# EAGLE design MegaBot (EAGLE 9.6.2)
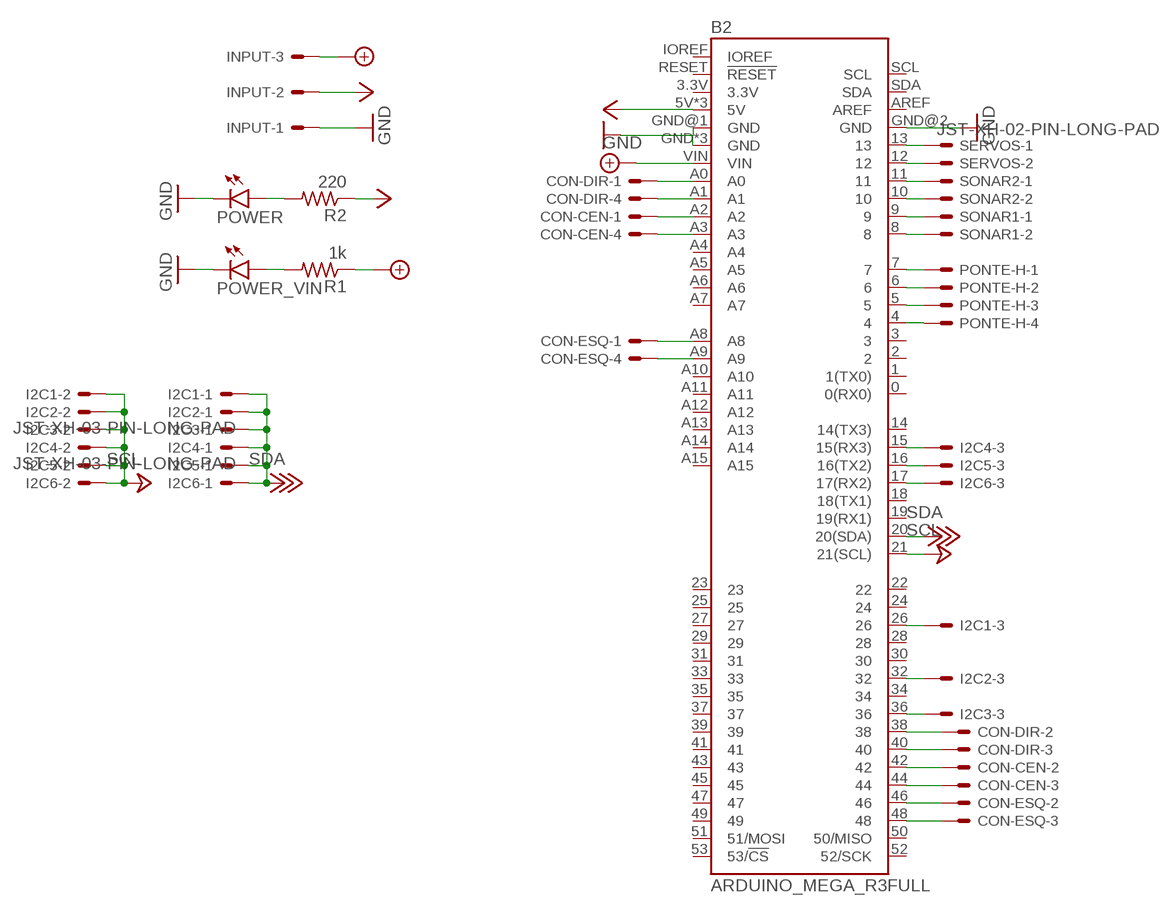
[diagram p0: schematic, sheet 1]

## Parts
B2  ARDUINO_MEGA_R3FULL  [ARDUINO_MEGA_NO_SILK]
CON-CEN  JST-XH-04-PIN-LONG-PAD  [JST-XH-04-PACKAGE-LONG-PAD]
CON-DIR  JST-XH-04-PIN-LONG-PAD  [JST-XH-04-PACKAGE-LONG-PAD]
CON-ESQ  JST-XH-04-PIN-LONG-PAD  [JST-XH-04-PACKAGE-LONG-PAD]
I2C1  JST-XH-03-PIN-LONG-PAD  [JST-XH-03-PACKAGE-LONG-PAD]
I2C2  JST-XH-03-PIN-LONG-PAD  [JST-XH-03-PACKAGE-LONG-PAD]
I2C3  JST-XH-03-PIN-LONG-PAD  [JST-XH-03-PACKAGE-LONG-PAD]
I2C4  JST-XH-03-PIN-LONG-PAD  [JST-XH-03-PACKAGE-LONG-PAD]
I2C5  JST-XH-03-PIN-LONG-PAD  [JST-XH-03-PACKAGE-LONG-PAD]
I2C6  JST-XH-03-PIN-LONG-PAD  [JST-XH-03-PACKAGE-LONG-PAD]
INPUT  KK-156-3  [KK-156-3]
PONTE-H  JST-XH-04-PIN-LONG-PAD  [JST-XH-04-PACKAGE-LONG-PAD]
POWER  LEDLED5MM_LONG_PAD  [LED5MM_LONG_PAD]
POWER_VIN  LEDLED5MM_LONG_PAD  [LED5MM_LONG_PAD]
R1  1k  R-US_0204/7  [0204/7]
R2  220  R-US_0204/7  [0204/7]
SERVOS  JST-XH-02-PIN-LONG-PAD  [JST-XH-02-PACKAGE-LONG-PAD]
SONAR1  JST-XH-02-PIN-LONG-PAD  [JST-XH-02-PACKAGE-LONG-PAD]
SONAR2  JST-XH-02-PIN-LONG-PAD  [JST-XH-02-PACKAGE-LONG-PAD]

## Nets
+8V: B2.VIN INPUT.3 R1.1
+18V: B2.20(20(SDA)) I2C1.1 I2C2.1 I2C3.1 I2C4.1 I2C5.1 I2C6.1 ; supply symbol labelled SDA
+24V: B2.21(21(SCL)) I2C1.2 I2C2.2 I2C3.2 I2C4.2 I2C5.2 I2C6.2 ; supply symbol labelled SCL
GND: B2.GND B2.GND@1(GND) B2.GND@2(GND) B2.GND@3(GND) B2.GND@4(GND) INPUT.1 POWER.K(C) POWER_VIN.K(C)
N$1: B2.7 PONTE-H.1
N$2: B2.6 PONTE-H.2
N$3: B2.5 PONTE-H.3
N$4: B2.4 PONTE-H.4
N$5: B2.38 CON-DIR.2
N$6: B2.40 CON-DIR.3
N$7: B2.42 CON-CEN.2
N$8: B2.44 CON-CEN.3
N$9: B2.46 CON-ESQ.2
N$10: B2.48 CON-ESQ.3
N$11: B2.A0 CON-DIR.1
N$12: B2.A1 CON-DIR.4
N$13: B2.A2 CON-CEN.1
N$14: B2.A3 CON-CEN.4
N$15: B2.A8 CON-ESQ.1
N$16: B2.A9 CON-ESQ.4
N$17: B2.11 SONAR2.1
N$18: B2.10 SONAR2.2
N$19: B2.9 SONAR1.1
N$20: B2.8 SONAR1.2
N$21: B2.26 I2C1.3
N$22: B2.32 I2C2.3
N$23: B2.36 I2C3.3
N$24: B2.15(15(RX3)) I2C4.3
N$25: B2.16(16(TX2)) I2C5.3
N$26: B2.17(17(RX2)) I2C6.3
N$27: B2.13 SERVOS.1
N$28: B2.12 SERVOS.2
N$29: POWER_VIN.A R1.2
N$32: POWER.A R2.2
VCC: B2.5V B2.5V@1(5V) B2.5V@2(5V) INPUT.2 R2.1
Unconnected: B2.0(0(RX0)) B2.1(1(TX0)) B2.2 B2.3 B2.3.3V B2.14(14(TX3)) B2.18(18(TX1)) B2.19(19(RX1)) B2.22 B2.23 B2.24 B2.25 B2.27 B2.28 B2.29 B2.30 B2.31 B2.33 B2.34 B2.35 B2.37 B2.39 B2.41 B2.43 B2.45 B2.47 B2.49 B2.50(50/MISO) B2.51(51/MOSI) B2.52(52/SCK) B2.53(53/!CS) B2.A4 B2.A5 B2.A6 B2.A7 B2.A10 B2.A11 B2.A12 B2.A13 B2.A14 B2.A15 B2.AREF B2.IOREF B2.RESET(!RESET) B2.SCL B2.SDA

## Library data of the parts
B2 = SparkFun-Boards:ARDUINO_MEGA_R3: Arduino Mega R3 ATmega2560 R3 compatible footprint. SparkFun Products: Arduino Mega 2560 R3 <https://www.sparkfun.com/products/11061>
CON-CEN CON-DIR CON-ESQ PONTE-H = Rembrandt Electronics - JST XH Connectors v1-0:JST-XH-04-PIN: JST XH Connector 2 Pin Wire to board connector. Pitch: 2,54 mm, (0.100") Number of pins: 4 Created by Rembrandt Electronics www.rembrandtelectronics.com
I2C1-I2C6 = Rembrandt Electronics - JST XH Connectors v1-0:JST-XH-03-PIN: JST XH Connector 2 Pin Wire to board connector. Pitch: 2,54 mm, (0.100") Number of pins: 3 Created by Rembrandt Electronics www.rembrandtelectronics.com
INPUT = con-molex:KK-156-3: KK 156 HEADER Source: http://www.molex.com/pdm_docs/sd/026604100_sd.pdf; MF: MOLEX; OC_FARNELL: unknown; OC_NEWARK: unknown
POWER POWER_VIN = led_robotica:LED: LED OSRAM: - CHIPLED LG R971, LG N971, LY N971, LG Q971, LY Q971, LO R971, LY R971 LH N974, LH R974 LS Q976, LO Q976, LY Q976 LO Q996 - Hyper CHIPLED LW Q18S LB Q993, LB Q99A, LB R99A - SideLED LS A670, LO A670, LY A670, LG A670, LP A670 LB A673, LV A673, LT A673, LW A673 LH A674 LY A675 LS A676, LA A676, LO A676, LY A676, LW A676 LS A679, LY A679, LG A679 - Hyper Micro SIDELED® LS Y876, LA Y876, LO Y876, LY Y876 LT Y87S - SmartLED LW L88C, LW L88S LB L89C, LB L89S, LG L890 LS L89K, LO L89K, LY L89K LS L896, LA L896, LO L896, LY L896 - TOPLED LS T670, LO T670, LY T670, LG T670, LP T670 LSG T670, LSP T670, LSY T670, LOP T670, LYG T670 LG T671, LOG T671, LSG T671 LB T673, LV T673, LT T673, LW T673 LH T674 LS T676, LA T676, LO T676, LY T676, LB T676, LH T676, LSB T676, LW T676 LB T67C, LV T67C, LT T67C, LS T67K, LO T67K, LY T67K, LW E67C LS E67B, LA E67B, LO E67B, LY E67B, LB E67C, LV E67C, LT E67C LW T67C LS T679, LY T679, LG T679 LS T770, LO T770, LY T770, LG T770, LP T770 LB T773, LV T773, LT T773, LW T773 LH T774 LS E675, LA E675, LY E675, LS T675 LS T776, LA T776, LO T776, LY T776, LB T776 LHGB T686 LT T68C, LB T68C - Hyper Mini TOPLED® LB M676 - Mini TOPLED Santana® LG M470 LS M47K, LO M47K, LY M47K Source: http://www.osram.convergy.de LUXEON: - LUMILED® LXK2-PW12-R00, LXK2-PW12-S00, LXK2-PW14-U00, LXK2-PW14-V00 LXK2-PM12-R00, LXK2-PM12-S00, LXK2-PM14-U00 LXK2-PE12-Q00, LXK2-PE12-R00, LXK2-PE12-S00, LXK2-PE14-T00, LXK2-PE14-U00 LXK2-PB12-K00, LXK2-PB12-L00, LXK2-PB12-M00, LXK2-PB14-N00, LXK2-PB14-P00, LXK2-PB14-Q00 LXK2-PR12-L00, LXK2-PR12-M00, LXK2-PR14-Q00, LXK2-PR14-R00 LXK2-PD12-Q00, LXK2-PD12-R00, LXK2-PD12-S00 LXK2-PH12-R00, LXK2-PH12-S00 LXK2-PL12-P00, LXK2-PL12-Q00, LXK2-PL12-R00 Source: www.luxeon.com KINGBRIGHT: KA-3528ASYC Source: www.kingbright.com
R1 R2 = rcl_robotica:R-US_: RESISTOR, American symbol; SPICEPREFIX: R
SERVOS SONAR1 SONAR2 = Rembrandt Electronics - JST XH Connectors v1-0:JST-XH-02-PIN: JST XH Connector 2 Pin Wire to board connector. Pitch: 2,54 mm, (0.100") Number of pins: 2 Created by Rembrandt Electronics www.rembrandtelectronics.com

## Board
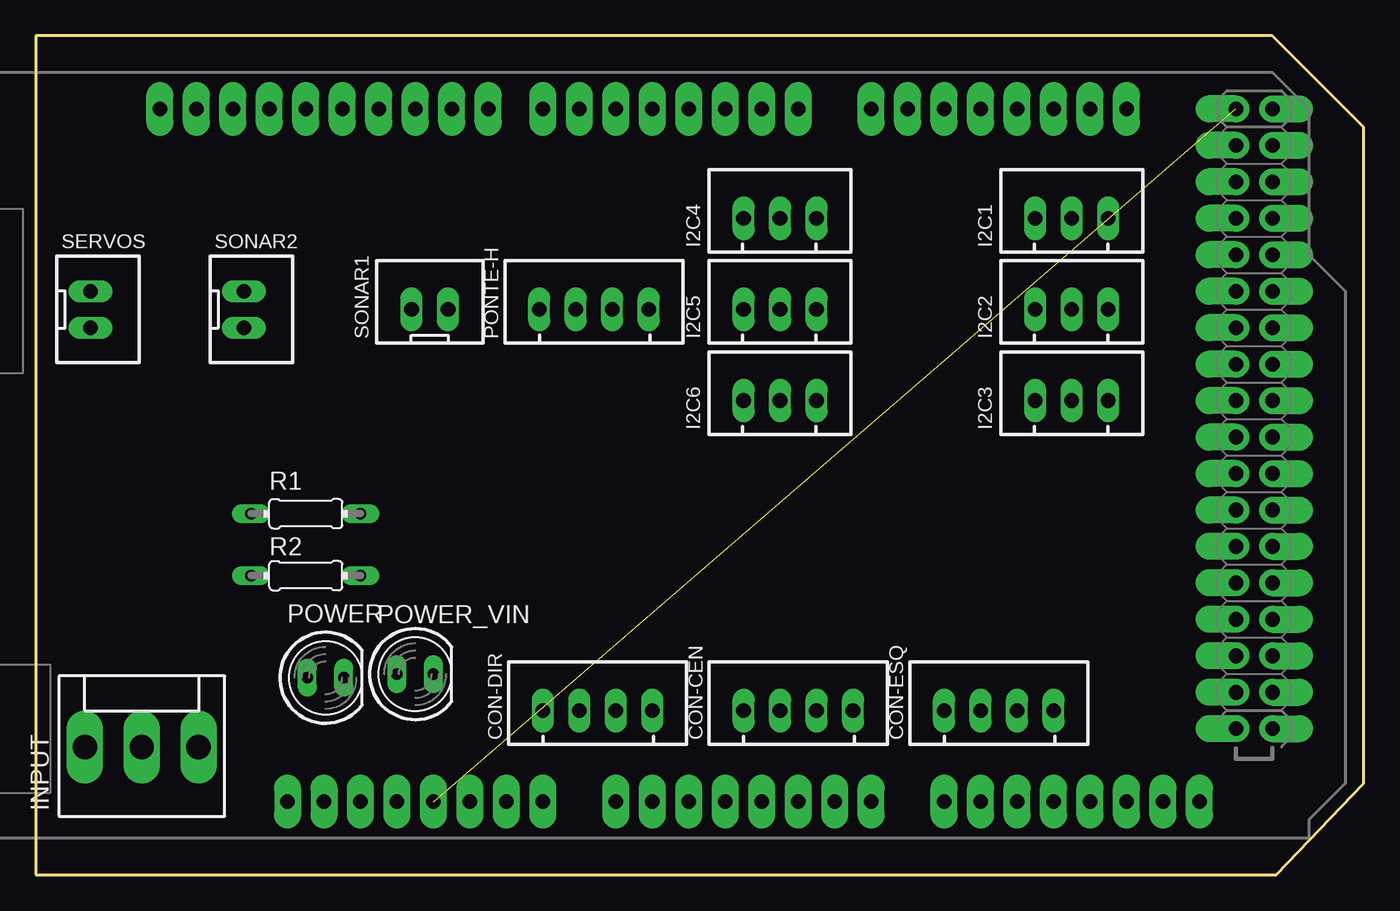
[diagram p1: board, top side]
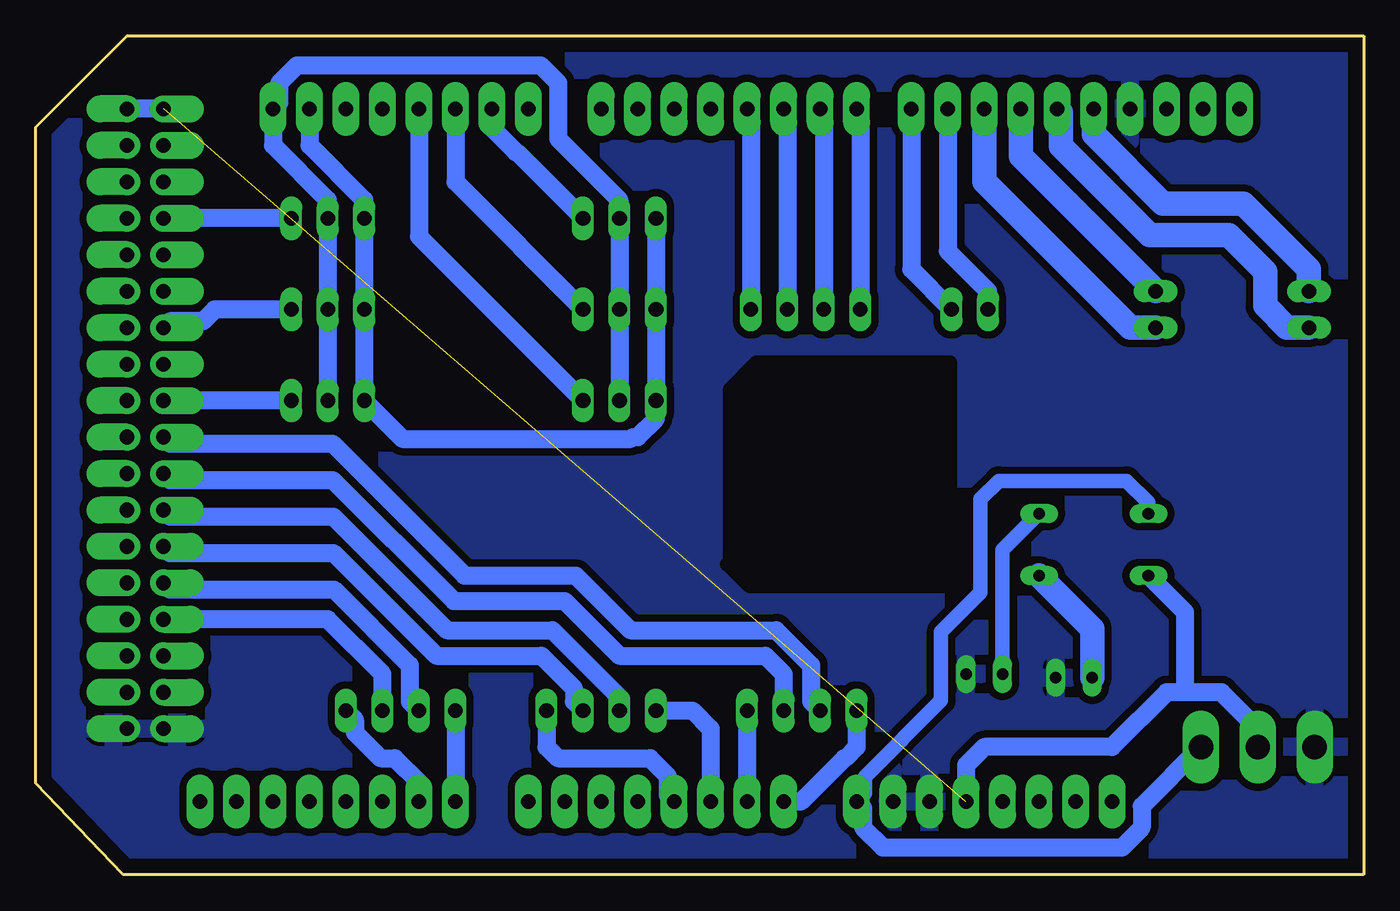
[diagram p2: board, bottom side, seen from below]

Size 92.46 x 58.42 mm. Coordinates in mm from the lower left corner, seen from the top.
Outline: 0,58.42 0,0 86.36,0 92.46,6.35 92.46,52.07 86.11,58.42 0,58.42
Copper layers (1*16): Top 0.035mm / dielectric 1.5mm / Bottom 0.035mm
Design rules "default *": minimum track width 6mil, minimum drill 0.35mm, track to track 20mil, track to pad 20mil, pad to pad 20mil, via to via 20mil, smd to smd 6mil, copper to edge 40mil, drill to drill 6mil, minimum pad ring 10mil, minimum via ring 8mil, stop-mask expansion 4mil, vias tented up to drill 0mil, thermal gap 10mil

### Footprints (pad centres in the part's own frame; a part is rotated, then mirrored left to right if it is on the bottom)
ARDUINO_MEGA_NO_SILK = drill 1.016 pad 1.88 long: 0 13.97,24.13; 1 11.43,24.13; 2 8.89,24.13; 3 6.35,24.13; 3.3V -13.97,-24.13; 4 3.81,24.13; 5 1.27,24.13; 5V -11.43,-24.13; 6 -1.27,24.13; 7 -3.81,24.13; 8 -7.62,24.13; 9 -10.16,24.13; 10 -12.7,24.13; 11 -15.24,24.13; 12 -17.78,24.13; 13 -20.32,24.13; 14 19.05,24.13; 15 21.59,24.13; 16 24.13,24.13; 17 26.67,24.13; 18 29.21,24.13; 19 31.75,24.13; 20 34.29,24.13; 21 36.83,24.13; A0 1.27,-24.13; A1 3.81,-24.13; A2 6.35,-24.13; A3 8.89,-24.13; A4 11.43,-24.13; A5 13.97,-24.13; A6 16.51,-24.13; A7 19.05,-24.13; A8 24.13,-24.13; A9 26.67,-24.13; A10 29.21,-24.13; A11 31.75,-24.13; A12 34.29,-24.13; A13 36.83,-24.13; A14 39.37,-24.13; A15 41.91,-24.13; AREF -25.4,24.13; GND -8.89,-24.13; GND@1 -6.35,-24.13; GND@4 -22.86,24.13; IOREF -19.05,-24.13; NC -21.59,-24.13; RESET -16.51,-24.13; SCL -30.48,24.13; SDA -27.94,24.13; VIN -3.81,-24.13 | drill 1.016 pad 1.88 offset: 5V@1 44.45,24.13; 5V@2 46.99,24.13; 22 44.45,21.59; 23 46.99,21.59; 24 44.45,19.05; 25 46.99,19.05; 26 44.45,16.51; 27 46.99,16.51; 28 44.45,13.97; 29 46.99,13.97; 30 44.45,11.43; 31 46.99,11.43; 32 44.45,8.89; 33 46.99,8.89; 34 44.45,6.35; 35 46.99,6.35; 36 44.45,3.81; 37 46.99,3.81; 38 44.45,1.27; 39 46.99,1.27; 40 44.45,-1.27; 41 46.99,-1.27; 42 44.45,-3.81; 43 46.99,-3.81; 44 44.45,-6.35; 45 46.99,-6.35; 46 44.45,-8.89; 47 46.99,-8.89; 48 44.45,-11.43; 49 46.99,-11.43; 50 44.45,-13.97; 51 46.99,-13.97; 52 44.45,-16.51; 53 46.99,-16.51; GND@2 44.45,-19.05; GND@3 46.99,-19.05
JST-XH-04-PACKAGE-LONG-PAD = drill 1.016 long: 1 -3.81,0; 2 -1.27,0; 3 1.27,0; 4 3.81,0
JST-XH-03-PACKAGE-LONG-PAD = drill 1.016 long: 1 -2.54,0; 2 0,0; 3 2.54,0
KK-156-3 = drill 1.7 pad 2.184 long: 1 -3.96,0; 2 0,0; 3 3.96,0
LED5MM_LONG_PAD = drill 0.813 long: A -1.27,0; K 1.27,0
0204/7 = drill 0.813 long: 1 -3.81,0; 2 3.81,0
JST-XH-02-PACKAGE-LONG-PAD = drill 1.016 long: 1 -1.27,0; 2 1.27,0

### Placement (x,y rotation side)
B2  39.12,29.21 0 top
CON-CEN  53.09,11.43 0 top
CON-DIR  39.12,11.43 0 top
CON-ESQ  67.06,11.43 0 top
I2C1  72.14,45.72 0 top
I2C2  72.14,39.37 0 top
I2C3  72.14,33.02 0 top
I2C4  51.82,45.72 0 top
I2C5  51.82,39.37 0 top
I2C6  51.82,33.02 0 top
INPUT  7.37,8.89 0 top
PONTE-H  38.86,39.37 0 top
POWER  20.17,13.72 0 top
POWER_VIN  26.42,13.97 0 top
R1  18.8,25.15 0 top
R2  18.8,20.83 0 top
SERVOS  3.81,39.37 270 top
SONAR1  27.43,39.37 0 top
SONAR2  14.48,39.37 270 top

### Tracks (layer width: path | path; a pad name or v marks a point on that pad's centre or on a via)
+8V
  Bottom 1.016: B2.VIN 34.72,5.66 34.72,6.83 29.43,12.13 29.43,16.91 26.67,19.67 26.67,26.16 25.4,27.43 16.51,27.43 14.99,25.91 R1.1
  Bottom 1.27: INPUT.3 15.44,4.77 15.44,3.28 16.82,1.9 33.48,1.9 34.85,3.28 34.85,4.62 B2.VIN
+18V
  Bottom 1.27: B2.20 73.41,50.8 69.6,46.99 I2C1.1 I2C2.1 I2C3.1 66.93,30.35 51.03,30.35 50.9,30.48 50.55,30.48 49.28,31.75 I2C6.1 I2C5.1 I2C4.1
+24V
  Bottom 1.27: I2C3.2 I2C2.2 I2C1.2 72.14,46.99 75.95,50.8 B2.21 75.49,53.8 75.49,55.14 74.27,56.36 57.3,56.36 56.08,55.14 56.08,51.26 51.82,46.99 I2C4.2 I2C5.2 I2C6.2
GND
  pour Bottom: -7.87,57.15 -7.87,5.08 2.29,-5.08 96.27,-5.08 101.35,0 101.35,53.34 92.46,62.23 -2.79,62.23
N100
  cutout Bottom: 28.8,35.66 28.8,21.02 29.7,20.12 42.78,20.12 42.84,20.18 44.28,21.62 44.34,21.62 44.13,21.83 44.13,33.8 42.27,35.66
N$1
  Bottom 1.27: B2.7 35.05,53.09 PONTE-H.1
N$2
  Bottom 1.27: B2.6 37.59,53.09 PONTE-H.2
N$3
  Bottom 1.27: B2.5 40.13,53.09 PONTE-H.3
N$4
  Bottom 1.27: B2.4 42.67,53.09 PONTE-H.4
N$5
  Bottom 1.27: B2.38 83.11,30.02 71.81,30.02 62.61,20.83 54.86,20.83 51.05,17.02 40.92,17.02 38.48,14.58 38.48,12.07 CON-DIR.2
N$6
  Bottom 1.27: B2.40 83.11,27.48 71.78,27.48 63.35,19.05 55.63,19.05 51.82,15.24 41.66,15.24 40.39,13.97 CON-DIR.3
N$7
  Bottom 1.27: B2.42 83.11,24.94 71.75,24.94 63.83,17.02 56.49,17.02 51.82,12.35 CON-CEN.2
N$8
  Bottom 1.27: B2.44 83.11,22.4 71.73,22.4 64.57,15.24 57.25,15.24 54.99,12.98 54.99,12.07 CON-CEN.3
N$9
  Bottom 1.27: B2.46 83.11,19.86 71.7,19.86 66.42,14.58 66.42,12.07 CON-ESQ.2
N$10
  Bottom 1.27: CON-ESQ.3 68.33,13.97 72.14,17.78 B2.48
N$11
  Bottom 1.27: CON-DIR.1 35.31,8.89 36.09,8.1 36.17,8.1 39.19,5.08 B2.A0
N$12
  Bottom 1.27: CON-DIR.4 B2.A1
N$13
  Bottom 1.27: CON-CEN.1 46.74,11.43 45.47,10.16 B2.A2
N$14
  Bottom 1.27: CON-CEN.4 56.9,8.89 56.11,8.1 49.68,8.1 48.46,6.88 48.46,5.54 B2.A3
N$15
  Bottom 1.27: CON-ESQ.1 B2.A8
N$16
  Bottom 1.27: CON-ESQ.4 70.23,10.79 70.23,9.88 68.45,8.1 67.46,8.1 65.79,6.43 B2.A9
N$17
  Bottom 1.7: B2.11 23.88,50.04 SONAR2.1
N$18
  Bottom 1.7: B2.10 26.42,48.26 16.26,38.1 SONAR2.2
N$19
  Bottom 1.27: B2.9 28.96,43.43 26.16,40.64 SONAR1.1
N$20
  Bottom 1.27: B2.8 31.5,42.16 SONAR1.2
N$21
  Bottom 1.27: I2C1.3 B2.26
N$22
  Bottom 1.27: I2C2.3 80.01,39.37 80.82,38.56 83.11,38.56 B2.32
N$23
  Bottom 1.27: I2C3.3 B2.36
N$24
  Bottom 1.27: I2C4.3 58.95,50.32 59.03,50.32 60.71,51.99 B2.15
N$25
  Bottom 1.27: B2.16 63.25,48.26 I2C5.3
N$26
  Bottom 1.27: B2.17 65.79,44.45 I2C6.3
N$27
  Bottom 1.7: B2.13 18.8,51.56 13.97,46.74 8.38,46.74 3.81,42.16 SERVOS.1
N$28
  Bottom 1.7: B2.12 21.09,53.1 21.09,50.74 14.89,44.53 9.4,44.53 6.86,41.99 6.86,39.62 5.33,38.1 SERVOS.2
N$29
  Bottom 1.016: R1.2 25.15,22.61 POWER_VIN.A
N$32
  Bottom 1.27: POWER.A
  Bottom 1.7: POWER.A 18.9,17.12 R2.2
VCC  (1 unrouted)
  Bottom 1.27: B2.5V@1 B2.5V@2 | INPUT.2 7.37,10.16 9.91,12.7 12.45,12.7 | 12.45,12.7 13.72,12.7 17.53,8.89 26.42,8.89 27.69,7.62 B2.5V | R2.1 12.45,18.29 12.45,12.7